# Altium project BW1092_R0M0E0.PrjPcb (part 7 of 7)

## Sheet BW1092_LEVEL_SHIFT.SchDoc: =project_title
size Tabloid; CompanyName: Luxonis Holding; DrawnBy: Brian Weinstein; Organization: Luxonis Holding; Address1: 1925 Harmony Park Drive; Address2: Westminster, CO; Address3: 80234; Address4: United States; DocumentNumber: DXXXX; Revision: R0M0E0; SheetNumber: 12; SheetTotal: 12
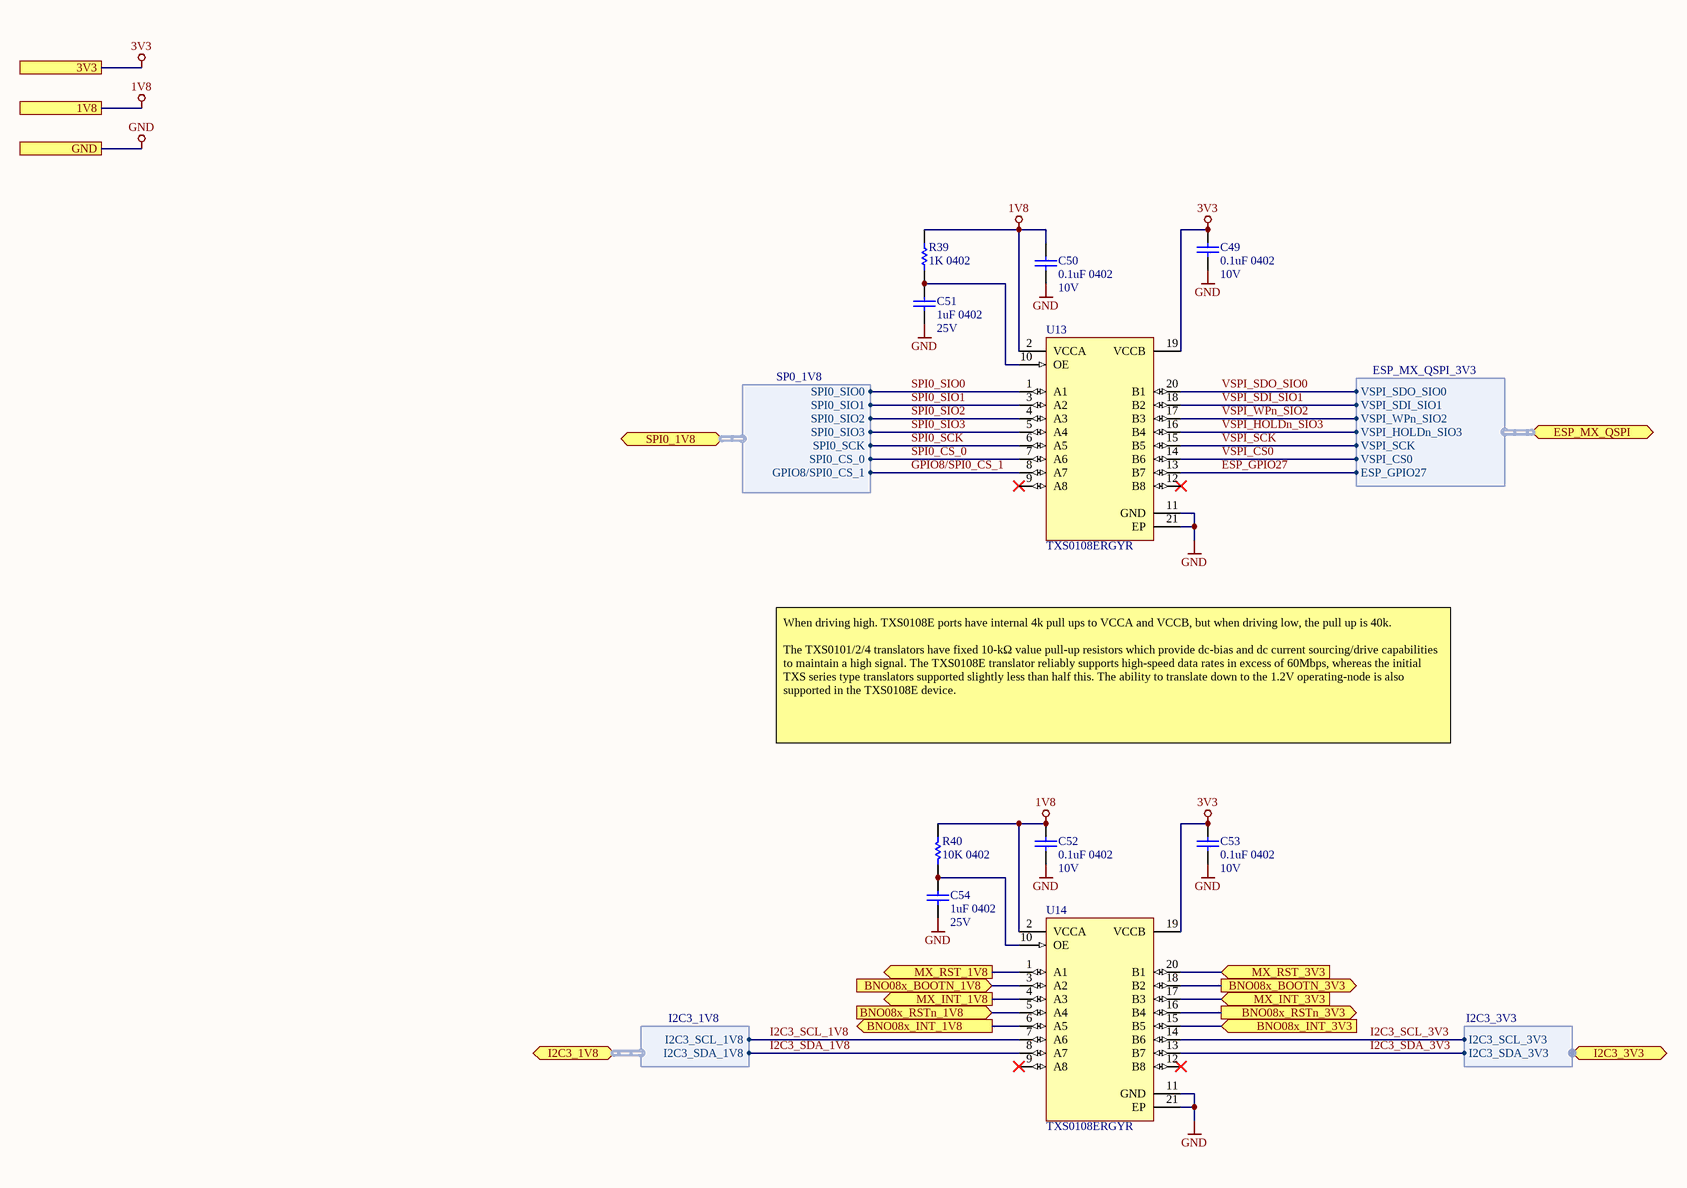
[diagram p10: BW1092_LEVEL_SHIFT.SchDoc]

### Parts
C49  0.1uF 0402  Voltage Rating: 10V  [CAPC0402(1005)70_N]
C50  0.1uF 0402  Voltage Rating: 10V  [CAPC0402(1005)70_N]
C51  1uF 0402  Voltage Rating: 25V  [CAPC0402(1005)70_N]
C52  0.1uF 0402  Voltage Rating: 10V  [CAPC0402(1005)70_N]
C53  0.1uF 0402  Voltage Rating: 10V  [CAPC0402(1005)70_N]
C54  1uF 0402  Voltage Rating: 25V  [CAPC0402(1005)70_N]
R39  1K 0402  [RESC0402(1005)_N]
R40  10K 0402  [RESC0402(1005)_N]
U13  TXS0108ERGYR  [TXS0108ERGYR]
U14  TXS0108ERGYR  [TXS0108ERGYR]

### Ports
1V8, 3V3, BNO08x_BOOTN_1V8 (in), BNO08x_BOOTN_3V3 (out), BNO08x_INT_1V8 (out), BNO08x_INT_3V3 (in), BNO08x_RSTn_1V8 (in), BNO08x_RSTn_3V3 (out), ESP_MX_QSPI (bidir, harness ESP_MX_QSPI_3V3), GND, I2C3_1V8 (bidir, harness I2C3_1V8), I2C3_3V3 (bidir, harness I2C3_3V3), MX_INT_1V8 (out), MX_INT_3V3 (in), MX_RST_1V8 (out), MX_RST_3V3 (in), SPI0_1V8 (bidir, harness SP0_1V8)

### Harnesses
I2C3_3V3: I2C3_SCL_3V3, I2C3_SDA_3V3
ESP_MX_QSPI_3V3: VSPI_CS0, VSPI_HOLDn_SIO3, VSPI_SCK, VSPI_SDI_SIO1, VSPI_SDO_SIO0, VSPI_WPn_SIO2, ESP_GPIO27
SP0_1V8: SPI0_SIO1, SPI0_SIO2, SPI0_SIO3, GPIO8/SPI0_CS_1, SPI0_SIO0, SPI0_CS_0, SPI0_SCK
I2C3_1V8: I2C3_SCL_1V8, I2C3_SDA_1V8

### Nets
1V8: C50.2 C52.2 R39.2 R40.1 U13.2(VCCA) U14.2(VCCA) ; port 1V8
3V3: C49.2 C53.2 U13.19(VCCB) U14.19(VCCB) ; port 3V3
GND: C49.1 C50.1 C51.1 C52.1 C53.1 C54.1 U13.11(GND) U13.21(EP) U14.11(GND) U14.21(EP) ; port GND
BNO08x_INT_3V3: U14.15(B5) ; port BNO08x_INT_3V3
BNO08x_RSTn_3V3: U14.16(B4) ; port BNO08x_RSTn_3V3
ESP_GPIO27: U13.13(B7) ; port ESP_MX_QSPI.ESP_GPIO27
GPIO8/SPI0_CS_1: U13.8(A7) ; port SPI0_1V8.GPIO8/SPI0_CS_1
I2C3_SCL_1V8: U14.7(A6) ; port I2C3_1V8.I2C3_SCL_1V8
I2C3_SCL_3V3: U14.14(B6) ; port I2C3_3V3.I2C3_SCL_3V3
I2C3_SDA_1V8: U14.8(A7) ; port I2C3_1V8.I2C3_SDA_1V8
I2C3_SDA_3V3: U14.13(B7) ; port I2C3_3V3.I2C3_SDA_3V3
MX_INT_1V8: U14.4(A3) ; port MX_INT_1V8
MX_INT_3V3: U14.17(B3) ; port MX_INT_3V3
MX_RST_1V8: U14.1(A1) ; port MX_RST_1V8
MX_RST_3V3: U14.20(B1) ; port MX_RST_3V3
SPI0_CS_0: U13.7(A6) ; port SPI0_1V8.SPI0_CS_0
SPI0_SCK: U13.6(A5) ; port SPI0_1V8.SPI0_SCK
SPI0_SIO0: U13.1(A1) ; port SPI0_1V8.SPI0_SIO0
SPI0_SIO1: U13.3(A2) ; port SPI0_1V8.SPI0_SIO1
SPI0_SIO2: U13.4(A3) ; port SPI0_1V8.SPI0_SIO2
SPI0_SIO3: U13.5(A4) ; port SPI0_1V8.SPI0_SIO3
VSPI_CS0: U13.14(B6) ; port ESP_MX_QSPI.VSPI_CS0
VSPI_HOLDn_SIO3: U13.16(B4) ; port ESP_MX_QSPI.VSPI_HOLDn_SIO3
VSPI_SCK: U13.15(B5) ; port ESP_MX_QSPI.VSPI_SCK
VSPI_SDI_SIO1: U13.18(B2) ; port ESP_MX_QSPI.VSPI_SDI_SIO1
VSPI_SDO_SIO0: U13.20(B1) ; port ESP_MX_QSPI.VSPI_SDO_SIO0
VSPI_WPn_SIO2: U13.17(B3) ; port ESP_MX_QSPI.VSPI_WPn_SIO2
NetC51_2: C51.2 R39.1 U13.10(OE)
NetC54_2: C54.2 R40.2 U14.10(OE)
NetJ1_4: U14.3(A2) ; port BNO08x_BOOTN_1V8
NetJ1_6: U14.5(A4) ; port BNO08x_RSTn_1V8
NetJ1_69: U14.6(A5) ; port BNO08x_INT_1V8
NetR36_2: U14.18(B2) ; port BNO08x_BOOTN_3V3

Not connected (* = marked no-connect by the designer): U13 9(A8)* 12(B8)*; U14 9(A8)* 12(B8)*

### Notes on the sheet
- When driving high. TXS0108E ports have internal 4k pull ups to VCCA and VCCB, but when driving low, the pull up is 40k.
  The TXS0101/2/4 translators have fixed 10-kΩ value pull-up resistors which provide dc-bias and dc current sourcing/drive capabilities to maintain a high signal. The TXS0108E translator reliably supports high-speed data rates in excess of 60Mbps, whereas the initial TXS series type translators supported slightly less than half this. The ability to translate down to the 1.2V operating-node is also supported in the TXS0108E device.
- Title
- Size:
- Date:
- Tabloid
- Number:
- Time:
- Revision:
- Sheet
- of
- Drawn by:

### Library data of the parts
C49 C50 C52 C53 = GRM155R71A104JA01D: CAP CER 0.1UF 10V X7R 0402 5%; Manufacturer 1: Murata; Capacitance: 100nF; Supplier 1: Digi-Key; Manufacturer Part Number 1: GRM155R71A104JA01D; Stock 1: 1346709; Pricing 1: 1=0.10000, 10=0.02500, 100=0.01130, 500=0.00806, 1000=0.00633, 2500=0.00575, 5000=0.00529 (USD); RoHS: Yes; Mount: Surface Mount; Case/Package: 0402; Case Code (Imperial): 0402; Case Code (Metric): 1005; Min Operating Temperature: -55°C; Max Operating Temperature: 125°C; Tolerance: 5%; Packaging: Tape and Reel; Voltage Rating (DC): 10V; Dielectric: X7R; Package Quantity: 10000; Termination: SMD/SMT; Length: 1mm; Height: 0.5mm; Width: 0.02inch; Thickness: 0.022inch; Depth: 0.5mm; Radiation Hardening: No; Lead Free: Lead Free; ComponentLink1URL: https://datasheet.ciiva.com/5411/product-5411135.pdf?src-supplier=Mouser; ComponentLink1Description: https://datasheet.ciiva.com/5411/product-5411135.pdf?src-supplier=Mouser; ComponentLink2URL: https://datasheet.ciiva.com/11618/c02e-11618821.pdf?src-supplier=Avnet; ComponentLink2Description: https://datasheet.ciiva.com/11618/c02e-11618821.pdf?src-supplier=Avnet; Supplier Part Number 1: 490-10777-1-ND
C51 C54 = GRM155R61E105KA12D: CAP CER 1UF 25V X5R 0402 10%; Manufacturer 1: Murata; Material: Ceramic; Supplier 1: Digi-Key; Manufacturer Part Number 1: GRM155R61E105KA12D; Stock 1: 200653; Pricing 1: 1=0.10000, 10=0.07100, 100=0.03350, 500=0.02352, 1000=0.01947, 2500=0.01812, 5000=0.01658 (USD); RoHS: Yes; Mount: Surface Mount; Case/Package: 0402; Weight: 0.000212oz; Case Code (Metric): 1005; Case Code (Imperial): 0402; Min Operating Temperature: -55°C; Max Operating Temperature: 85°C; Tolerance: 10%; Capacitance: 1uF; Dielectric: X5R; Voltage Rating (DC): 25V; Packaging: Tape and Reel; Package Quantity: 10000; Termination: SMD/SMT; Voltage: 25V; Length: 1mm; Height: 0.5mm; Width: 0.5mm; Thickness: 0.022inch; Depth: 0.5mm; Lead Free: Lead Free; REACH SVHC: No SVHC; ComponentLink1URL: https://datasheet.ciiva.com/22732/1666664-22732122.pdf?src-supplier=Element14; ComponentLink1Description: https://datasheet.ciiva.com/22732/1666664-22732122.pdf?src-supplier=Element14; ComponentLink2URL: https://datasheet.ciiva.com/7719/1666664-7719006.pdf?src-supplier=Element14; ComponentLink2Description: https://datasheet.ciiva.com/7719/1666664-7719006.pdf?src-supplier=Element14; Supplier Part Number 1: 490-10017-1-ND; Supplier 2: Arrow; Supplier 3: TTI; Supplier Part Number 2: GRM155R61E105KA12D; Supplier Part Number 3: GRM155R61E105KA12D
R39 = RC0402FR-071KL: RES SMD 1K OHM 1% 1/16W 0402 1 kOhms ±1% 0.063W, 1/16W Chip Resistor 0402 (1005 Metric) Moisture Resistant Thick Film; Manufacturer 1: Yageo; Temperature Coefficient: 100ppm/°C; Power Rating: 62.5mW; Voltage Rating (DC): 50V; Resistance: 1kR; RoHS: Yes; Number of Pins: 2; Case Code (Imperial): 0402; Case Code (Metric): 1005; Min Operating Temperature: -55°C; Max Operating Temperature: 155°C; Packaging: Tape and Reel; Composition: Thick Film; Voltage Rating: 50V; Military Standard: Not; Termination: SMD/SMT; Length: 1mm; Height: 0.32mm; Width: 0.5mm; Depth: 0.5mm; Lead Free: Lead Free; REACH SVHC: Unknown; ComponentLink1URL: https://datasheet.ciiva.com/11819/0900766b80c66297-11819477.pdf?src-supplier=RSComponents; ComponentLink1Description: https://datasheet.ciiva.com/11819/0900766b80c66297-11819477.pdf?src-supplier=RSComponents; ComponentLink2URL: https://datasheet.ciiva.com/12666/pyu-rc0402-51-rohs-l-6-r-12666741.pdf?src-supplier=Mouser; ComponentLink2Description: https://datasheet.ciiva.com/12666/pyu-rc0402-51-rohs-l-6-r-12666741.pdf?src-supplier=Mouser; ComponentLink3URL: https://datasheet.ciiva.com/17063/pyu-rc0402-51-rohs-l-6-r-17063193.pdf?src-supplier=Future+Electronics; ComponentLink3Description: https://datasheet.ciiva.com/17063/pyu-rc0402-51-rohs-l-6-r-17063193.pdf?src-supplier=Future+Electronics; ComponentLink4URL: https://datasheet.ciiva.com/22747/1018594-22747513.pdf?src-supplier=Element14; ComponentLink4Description: https://datasheet.ciiva.com/22747/1018594-22747513.pdf?src-supplier=Element14; ComponentLink5URL: https://datasheet.ciiva.com/7849/1018594-7849869.pdf?src-supplier=Element14; ComponentLink5Description: https://datasheet.ciiva.com/7849/1018594-7849869.pdf?src-supplier=Element14; ComponentLink6URL: https://datasheet.ciiva.com/7983/1018594-7983502.pdf?src-supplier=Element14; ComponentLink6Description: https://datasheet.ciiva.com/7983/1018594-7983502.pdf?src-supplier=Element14; ComponentLink7URL: https://datasheet.ciiva.com/7849/1018594-7849871.pdf?src-supplier=Element14; ComponentLink7Description: https://datasheet.ciiva.com/7849/1018594-7849871.pdf?src-supplier=Element14; Supplier 1: Digi-Key; Manufacturer Part Number 1: RC0402FR-071KL; Stock 1: 60695854; Pricing 1: 1=0.10000, 10=0.01600, 100=0.00670, 1000=0.00301, 2500=0.00261, 5000=0.00215 (USD); Case/Package: 0402; Tolerance: 1%; Supplier Part Number 1: 311-1.00KLRCT-ND
R40 = RC0402FR-1310KL: as R11-R14 on sheet BW1092_USB; ComponentLink1URL: https://datasheet.ciiva.com/16940/pyu-rc0402-51-rohs-l-6-16940293.pdf?src-supplier=Avnet+Europe; ComponentLink1Description: https://datasheet.ciiva.com/16940/pyu-rc0402-51-rohs-l-6-16940293.pdf?src-supplier=Avnet+Europe; ComponentLink2URL: https://datasheet.ciiva.com/28386/pyu-rc0402-51-rohs-l-6-28386855.pdf?src-supplier=Avnet+Europe; ComponentLink2Description: https://datasheet.ciiva.com/28386/pyu-rc0402-51-rohs-l-6-28386855.pdf?src-supplier=Avnet+Europe; ComponentLink3URL: https://datasheet.ciiva.com/16740/pyu-rc0402-51-rohs-l-6-r-16740602.pdf?src-supplier=Future+Electronics; ComponentLink3Description: https://datasheet.ciiva.com/16740/pyu-rc0402-51-rohs-l-6-r-16740602.pdf?src-supplier=Future+Electronics; ComponentLink4URL: https://datasheet.ciiva.com/8891/pyu-rc0402-51-rohs-l-6-8891339.pdf?src-supplier=Avnet; ComponentLink4Description: https://datasheet.ciiva.com/8891/pyu-rc0402-51-rohs-l-6-8891339.pdf?src-supplier=Avnet; ComponentLink5URL: https://datasheet.ciiva.com/5557/pyu-rc0402-51-rohs-l-6-r-5557997.pdf?src-supplier=Mouser; ComponentLink5Description: https://datasheet.ciiva.com/5557/pyu-rc0402-51-rohs-l-6-r-5557997.pdf?src-supplier=Mouser; ComponentLink6URL: https://datasheet.ciiva.com/7983/1018594-7983533.pdf?src-supplier=Element14; ComponentLink6Description: https://datasheet.ciiva.com/7983/1018594-7983533.pdf?src-supplier=Element14; Supplier 1: Newark; Manufacturer Part Number 1: RC0402FR-1310KL; Stock 1: 62239; Pricing 1: 1=0.10000, 25=0.01200, 100=0.00400, 250=0.00400, 500=0.00300, 1000=0.00300 (USD); RoHS: Yes; Case/Package: 0402; Number of Pins: 2; Contact Plating: Tin,Matte,Lead; Case Code (Imperial): 0402; Case Code (Metric): 1005; Min Operating Temperature: -55°C; Max Operating Temperature: 155°C; Tolerance: 1%; Composition: Thick Film; Packaging: Tape and Reel; Termination: SMD/SMT; Military Standard: Not; Voltage Rating (DC): 50V; Working Voltage: 50V; Number of Terminations: 2; Length: 1mm; Depth: 0.5mm; Radiation Hardening: No; REACH SVHC: No SVHC; Lead Free: Lead Free; Supplier Part Number 1: 67R9960; Supplier 2: Future Electronics; Supplier 3: Mouser; Supplier 4: Element14; Supplier Part Number 2: RC0402FR-1310KL-CUTT; Supplier Part Number 3: 603-RC0402FR-1310KL; Supplier Part Number 4: 1799235
U13 U14 = TXS0108ERGYR: IC TRNSLTR BIDIRECTIONAL 20VQFN; Manufacturer 1: Texas Instruments; Logic Function: Translator; Number of Bits: 8; Turn-On Delay Time: 312ns; High Level Output Current: -50mA; Low Level Output Current: 50mA; Quiescent Current: 3uA; Propagation Delay: 4.8ns; Min Supply Voltage: 1.2V; Max Supply Voltage: 5.5V; Data Rate: 60Mbps; Output Type: Voltage; Supplier 1: Digi-Key; Manufacturer Part Number 1: TXS0108ERGYR; RoHS: Yes; Category: Integrated Circuits (ICs); Stock 1: 122729; Pricing 1: 1=1.42000, 10=1.26600, 25=1.20120, 100=0.98670, 250=0.92236, 500=0.81510, 1000=0.64350 (USD); Mount: Surface Mount; Case/Package: VQFN; Number of Pins: 20; Weight: 0.001517oz; Min Operating Temperature: -40°C; Max Operating Temperature: 85°C; Number of Inputs: 8; Packaging: Tape and Reel; Package Quantity: 1; Number of Channels: 8; Radiation Hardening: No; Lead Free: Lead Free; REACH SVHC: No SVHC; ComponentLink1URL: https://datasheet.ciiva.com/15096/getdatasheetpartid-189651-15096225.pdf?src-supplier=Verical; ComponentLink1Description: https://datasheet.ciiva.com/15096/getdatasheetpartid-189651-15096225.pdf?src-supplier=Verical; ComponentLink2URL: https://datasheet.ciiva.com/22659/1718976-22659572.pdf?src-supplier=Element14; ComponentLink2Description: https://datasheet.ciiva.com/22659/1718976-22659572.pdf?src-supplier=Element14; ComponentLink3URL: https://datasheet.ciiva.com/26185/txs0108e-26185177.pdf?src-supplier=Avnet+Europe; ComponentLink3Description: https://datasheet.ciiva.com/26185/txs0108e-26185177.pdf?src-supplier=Avnet+Europe; ComponentLink4URL: https://datasheet.ciiva.com/14287/txs0108e-14287692.pdf?src-supplier=Avnet; ComponentLink4Description: https://datasheet.ciiva.com/14287/txs0108e-14287692.pdf?src-supplier=Avnet; ComponentLink5URL: https://datasheet.ciiva.com/1899/txs0108e-1899610.pdf?src-supplier=Digi-Key; ComponentLink5Description: https://datasheet.ciiva.com/1899/txs0108e-1899610.pdf?src-supplier=Digi-Key; ComponentLink6URL: https://datasheet.ciiva.com/1899/txs0108e-1899611.pdf?src-supplier=Digi-Key; ComponentLink6Description: https://datasheet.ciiva.com/1899/txs0108e-1899611.pdf?src-supplier=Digi-Key; ComponentLink7URL: https://datasheet.ciiva.com/1899/txs0108e-1899612.pdf?src-supplier=Digi-Key; ComponentLink7Description: https://datasheet.ciiva.com/1899/txs0108e-1899612.pdf?src-supplier=Digi-Key; ComponentLink8URL: https://datasheet.ciiva.com/14287/txs0108e-14287533.pdf?src-supplier=Avnet; ComponentLink8Description: https://datasheet.ciiva.com/14287/txs0108e-14287533.pdf?src-supplier=Avnet; ComponentLink9URL: https://datasheet.ciiva.com/48701/001073880-da-01-en-ic-xlatr-volt-lv-txs0108ergyr-qfn-20-tid-48701964.pdf?src-supplier=Conrad; ComponentLink9Description: https://datasheet.ciiva.com/48701/001073880-da-01-en-ic-xlatr-volt-lv-txs0108ergyr-qfn-20-tid-48701964.pdf?src-supplier=Conrad; Supplier 2: Digi-Key; Supplier 3: Arrow; Supplier 4: TI store; Supplier 5: Mouser; Supplier Part Number 1: 296-24806-1-ND; Supplier Part Number 2: 296-24806-2-ND; Supplier Part Number 3: TXS0108ERGYR; Supplier Part Number 4: TXS0108ERGYR; Supplier Part Number 5: 595-TXS0108ERGYR

## Nets that join several sheets
1V2: BW1092_Power_Supply (C39.2 TP10.1 U8.5), BW1092_RIGHT_OV9282 (FB9.1), BW1092_LEFT_OV9282 (FB6.1)
1V05: BW1092_Power_Supply (5 pins), BW1092_IMX378 (FB3.1)
1V8: BW1092_Power_Supply (C18.2 TP11.1 U2.5), BW1092_IMX378 (FB2.1), BW1092_RIGHT_OV9282 (FB8.1), BW1092_LEFT_OV9282 (FB5.1), BW1092_LEVEL_SHIFT (6 pins)
2V8: BW1092_Power_Supply (C20.2 TP12.1 U3.5), BW1092_IMX378 (FB1.1), BW1092_RIGHT_OV9282 (FB7.1), BW1092_LEFT_OV9282 (FB4.1)
3V3: BW1092_Power_Supply (C16.1 L2.2 R5.2), BW1092_USB (C35.2 R13.2 U5.6), BW1092_ESP32 (5 pins), BW1092_IMU (10 pins), BW1092_LEVEL_SHIFT (C49.2 C53.2 U13.19 U14.19)
GND: BW1092_TopLevel (MP5.1 MP6.1 MP7.1 MP8.1), BW1092_Power_Supply (33 pins), BW1092_Connector (43 pins), BW1092_IMX378 (16 pins), BW1092_RIGHT_OV9282 (16 pins), BW1092_LEFT_OV9282 (16 pins), BW1092_USB (27 pins), BW1092_ESP32 (23 pins), BW1092_IMU (12 pins), BW1092_LEVEL_SHIFT (10 pins)
VBUS: BW1092_Power_Supply (TP8.1 U9.1 U10.3), BW1092_Connector (J1.53), BW1092_USB (10 pins)
VDD_5V: BW1092_Power_Supply (22 pins), BW1092_Connector (14 pins), BW1092_USB (C36.2 R20.2 R21.2 U6.12)
BNO08x_INT_3V3: BW1092_IMU (U12.14), BW1092_LEVEL_SHIFT (U14.15)
BNO08x_RSTn_3V3: BW1092_IMU (U12.11), BW1092_LEVEL_SHIFT (U14.16)
CAM_A_CLK_OUT: BW1092_Connector (J1.28), BW1092_IMX378 (J2.30)
CAM_A_PWDN_N: BW1092_Connector (J1.34), BW1092_IMX378 (J2.23 R1.1)
CAM_B_CLK_OUT: BW1092_Connector (J1.73), BW1092_RIGHT_OV9282 (J9.24), BW1092_LEFT_OV9282 (J3.24)
CAM_B_D_PWM: BW1092_Connector (J1.65), BW1092_RIGHT_OV9282 (J9.22 R9.1)
CAM_B_PWDN_N: BW1092_Connector (J1.67), BW1092_LEFT_OV9282 (J3.22 R2.1)
COM_AUX_IO2: BW1092_Connector (J1.42 TP4.1), BW1092_LEFT_OV9282 (R4.1)
ESP_GPIO2: BW1092_Connector (J1.40), BW1092_ESP32 (J6.2 U11.24)
ESP_GPIO4: BW1092_Connector (J1.38), BW1092_ESP32 (J6.3 U11.26)
ESP_GPIO12: BW1092_Connector (J1.63), BW1092_ESP32 (J6.4 U11.14)
ESP_GPIO13: BW1092_Connector (J1.61), BW1092_ESP32 (J6.5 U11.16)
ESP_GPIO14: BW1092_Connector (J1.36), BW1092_ESP32 (J6.6 U11.13)
ESP_GPIO15: BW1092_Connector (J1.32), BW1092_ESP32 (J6.7 U11.23)
ESP_GPIO27: BW1092_ESP32 (TP47.1 U11.12), BW1092_LEVEL_SHIFT (U13.13)
FSIN2: BW1092_RIGHT_OV9282 (R10.2), BW1092_LEFT_OV9282 (R23.2 R26.2)
GPIO8/SPI0_CS_1: BW1092_Connector (J1.60), BW1092_LEVEL_SHIFT (U13.8)
I2C1_SCL: BW1092_Connector (J1.35), BW1092_IMX378 (J2.20)
I2C1_SDA: BW1092_Connector (J1.33), BW1092_IMX378 (J2.19)
I2C2_SCL: BW1092_Connector (J1.77), BW1092_RIGHT_OV9282 (J9.21), BW1092_LEFT_OV9282 (J3.21)
I2C2_SDA: BW1092_Connector (J1.79), BW1092_RIGHT_OV9282 (J9.20), BW1092_LEFT_OV9282 (J3.20)
I2C3_SCL_1V8: BW1092_Connector (J1.78), BW1092_LEVEL_SHIFT (U14.7)
I2C3_SCL_3V3: BW1092_ESP32 (TP43.1 U11.10), BW1092_IMU (U12.19), BW1092_LEVEL_SHIFT (U14.14)
I2C3_SDA_1V8: BW1092_Connector (J1.80), BW1092_LEVEL_SHIFT (U14.8)
I2C3_SDA_3V3: BW1092_ESP32 (TP46.1 U11.11), BW1092_IMU (U12.20), BW1092_LEVEL_SHIFT (U14.13)
MIPI_RX2_C_N: BW1092_Connector (J1.95), BW1092_LEFT_OV9282 (J3.11)
MIPI_RX2_C_P: BW1092_Connector (J1.97), BW1092_LEFT_OV9282 (J3.10)
MIPI_RX2_D0_N: BW1092_Connector (J1.89), BW1092_LEFT_OV9282 (J3.8)
MIPI_RX2_D0_P: BW1092_Connector (J1.91), BW1092_LEFT_OV9282 (J3.7)
MIPI_RX2_D1_N: BW1092_Connector (J1.83), BW1092_LEFT_OV9282 (J3.5)
MIPI_RX2_D1_P: BW1092_Connector (J1.85), BW1092_LEFT_OV9282 (J3.4)
MIPI_RX3_C_N: BW1092_Connector (J1.96), BW1092_RIGHT_OV9282 (J9.11)
MIPI_RX3_C_P: BW1092_Connector (J1.98), BW1092_RIGHT_OV9282 (J9.10)
MIPI_RX3_D0_N: BW1092_Connector (J1.90), BW1092_RIGHT_OV9282 (J9.8)
MIPI_RX3_D0_P: BW1092_Connector (J1.92), BW1092_RIGHT_OV9282 (J9.7)
MIPI_RX3_D1_N: BW1092_Connector (J1.84), BW1092_RIGHT_OV9282 (J9.5)
MIPI_RX3_D1_P: BW1092_Connector (J1.86), BW1092_RIGHT_OV9282 (J9.4)
MIPI_RX4_C_N: BW1092_Connector (J1.3), BW1092_IMX378 (J2.28)
MIPI_RX4_C_P: BW1092_Connector (J1.5), BW1092_IMX378 (J2.27)
MIPI_RX4_D0_N: BW1092_Connector (J1.9), BW1092_IMX378 (J2.5)
MIPI_RX4_D0_P: BW1092_Connector (J1.11), BW1092_IMX378 (J2.6)
MIPI_RX4_D1_N: BW1092_Connector (J1.15), BW1092_IMX378 (J2.26)
MIPI_RX4_D1_P: BW1092_Connector (J1.17), BW1092_IMX378 (J2.25)
MIPI_RX5_D0_N: BW1092_Connector (J1.21), BW1092_IMX378 (J2.8)
MIPI_RX5_D0_P: BW1092_Connector (J1.23), BW1092_IMX378 (J2.9)
MIPI_RX5_D1_N: BW1092_Connector (J1.27), BW1092_IMX378 (J2.2)
MIPI_RX5_D1_P: BW1092_Connector (J1.29), BW1092_IMX378 (J2.3)
MX_INT_1V8: BW1092_Connector (J1.59), BW1092_LEVEL_SHIFT (U14.4)
MX_INT_3V3: BW1092_ESP32 (TP36.1 U11.8), BW1092_LEVEL_SHIFT (U14.17)
MX_RST_1V8: BW1092_Connector (5 pins), BW1092_LEVEL_SHIFT (U14.1)
MX_RST_3V3: BW1092_ESP32 (TP45.1 U11.9), BW1092_LEVEL_SHIFT (U14.20)
NetJ1_4: BW1092_Connector (J1.4), BW1092_LEVEL_SHIFT (U14.3)
NetJ1_6: BW1092_Connector (J1.6), BW1092_LEVEL_SHIFT (U14.5)
NetJ1_69: BW1092_Connector (J1.69), BW1092_LEVEL_SHIFT (U14.6)
NetR36_2: BW1092_IMU (R36.2), BW1092_LEVEL_SHIFT (U14.18)
SPI0_CS_0: BW1092_Connector (J1.70), BW1092_LEVEL_SHIFT (U13.7)
SPI0_SCK: BW1092_Connector (J1.74), BW1092_LEVEL_SHIFT (U13.6)
SPI0_SIO0: BW1092_Connector (J1.62), BW1092_LEVEL_SHIFT (U13.1)
SPI0_SIO1: BW1092_Connector (J1.64), BW1092_LEVEL_SHIFT (U13.3)
SPI0_SIO2: BW1092_Connector (J1.66), BW1092_LEVEL_SHIFT (U13.4)
SPI0_SIO3: BW1092_Connector (J1.68), BW1092_LEVEL_SHIFT (U13.5)
USB_D_N: BW1092_Connector (J1.18), BW1092_USB (D6.1 D6.10 J10.A7 J10.B7)
USB_D_P: BW1092_Connector (J1.16), BW1092_USB (D6.2 D6.9 J10.A6 J10.B6)
USB_RX_N: BW1092_Connector (J1.12), BW1092_USB (U5.7)
USB_RX_P: BW1092_Connector (J1.10), BW1092_USB (U5.8)
USB_TX_N: BW1092_Connector (J1.24), BW1092_USB (U5.3)
USB_TX_P: BW1092_Connector (J1.22), BW1092_USB (U5.4)
VSPI_CS0: BW1092_ESP32 (TP44.1 U11.29), BW1092_LEVEL_SHIFT (U13.14)
VSPI_HOLDn_SIO3: BW1092_ESP32 (TP40.1 U11.33), BW1092_LEVEL_SHIFT (U13.16)
VSPI_SCK: BW1092_ESP32 (TP42.1 U11.30), BW1092_LEVEL_SHIFT (U13.15)
VSPI_SDI_SIO1: BW1092_ESP32 (TP41.1 U11.31), BW1092_LEVEL_SHIFT (U13.18)
VSPI_SDO_SIO0: BW1092_ESP32 (TP31.1 U11.37), BW1092_LEVEL_SHIFT (U13.20)
VSPI_WPn_SIO2: BW1092_ESP32 (TP33.1 U11.36), BW1092_LEVEL_SHIFT (U13.17)

## Assembly variants
Production: not fitted C37 D1 J4 J5 J6 J? J? J? MISC1 R6 R18 R19 R22 R23 R25 R27 R28 R29 R30 R? U7